# EAGLE schematic mbmc_single_board (EAGLE 9.6.2)
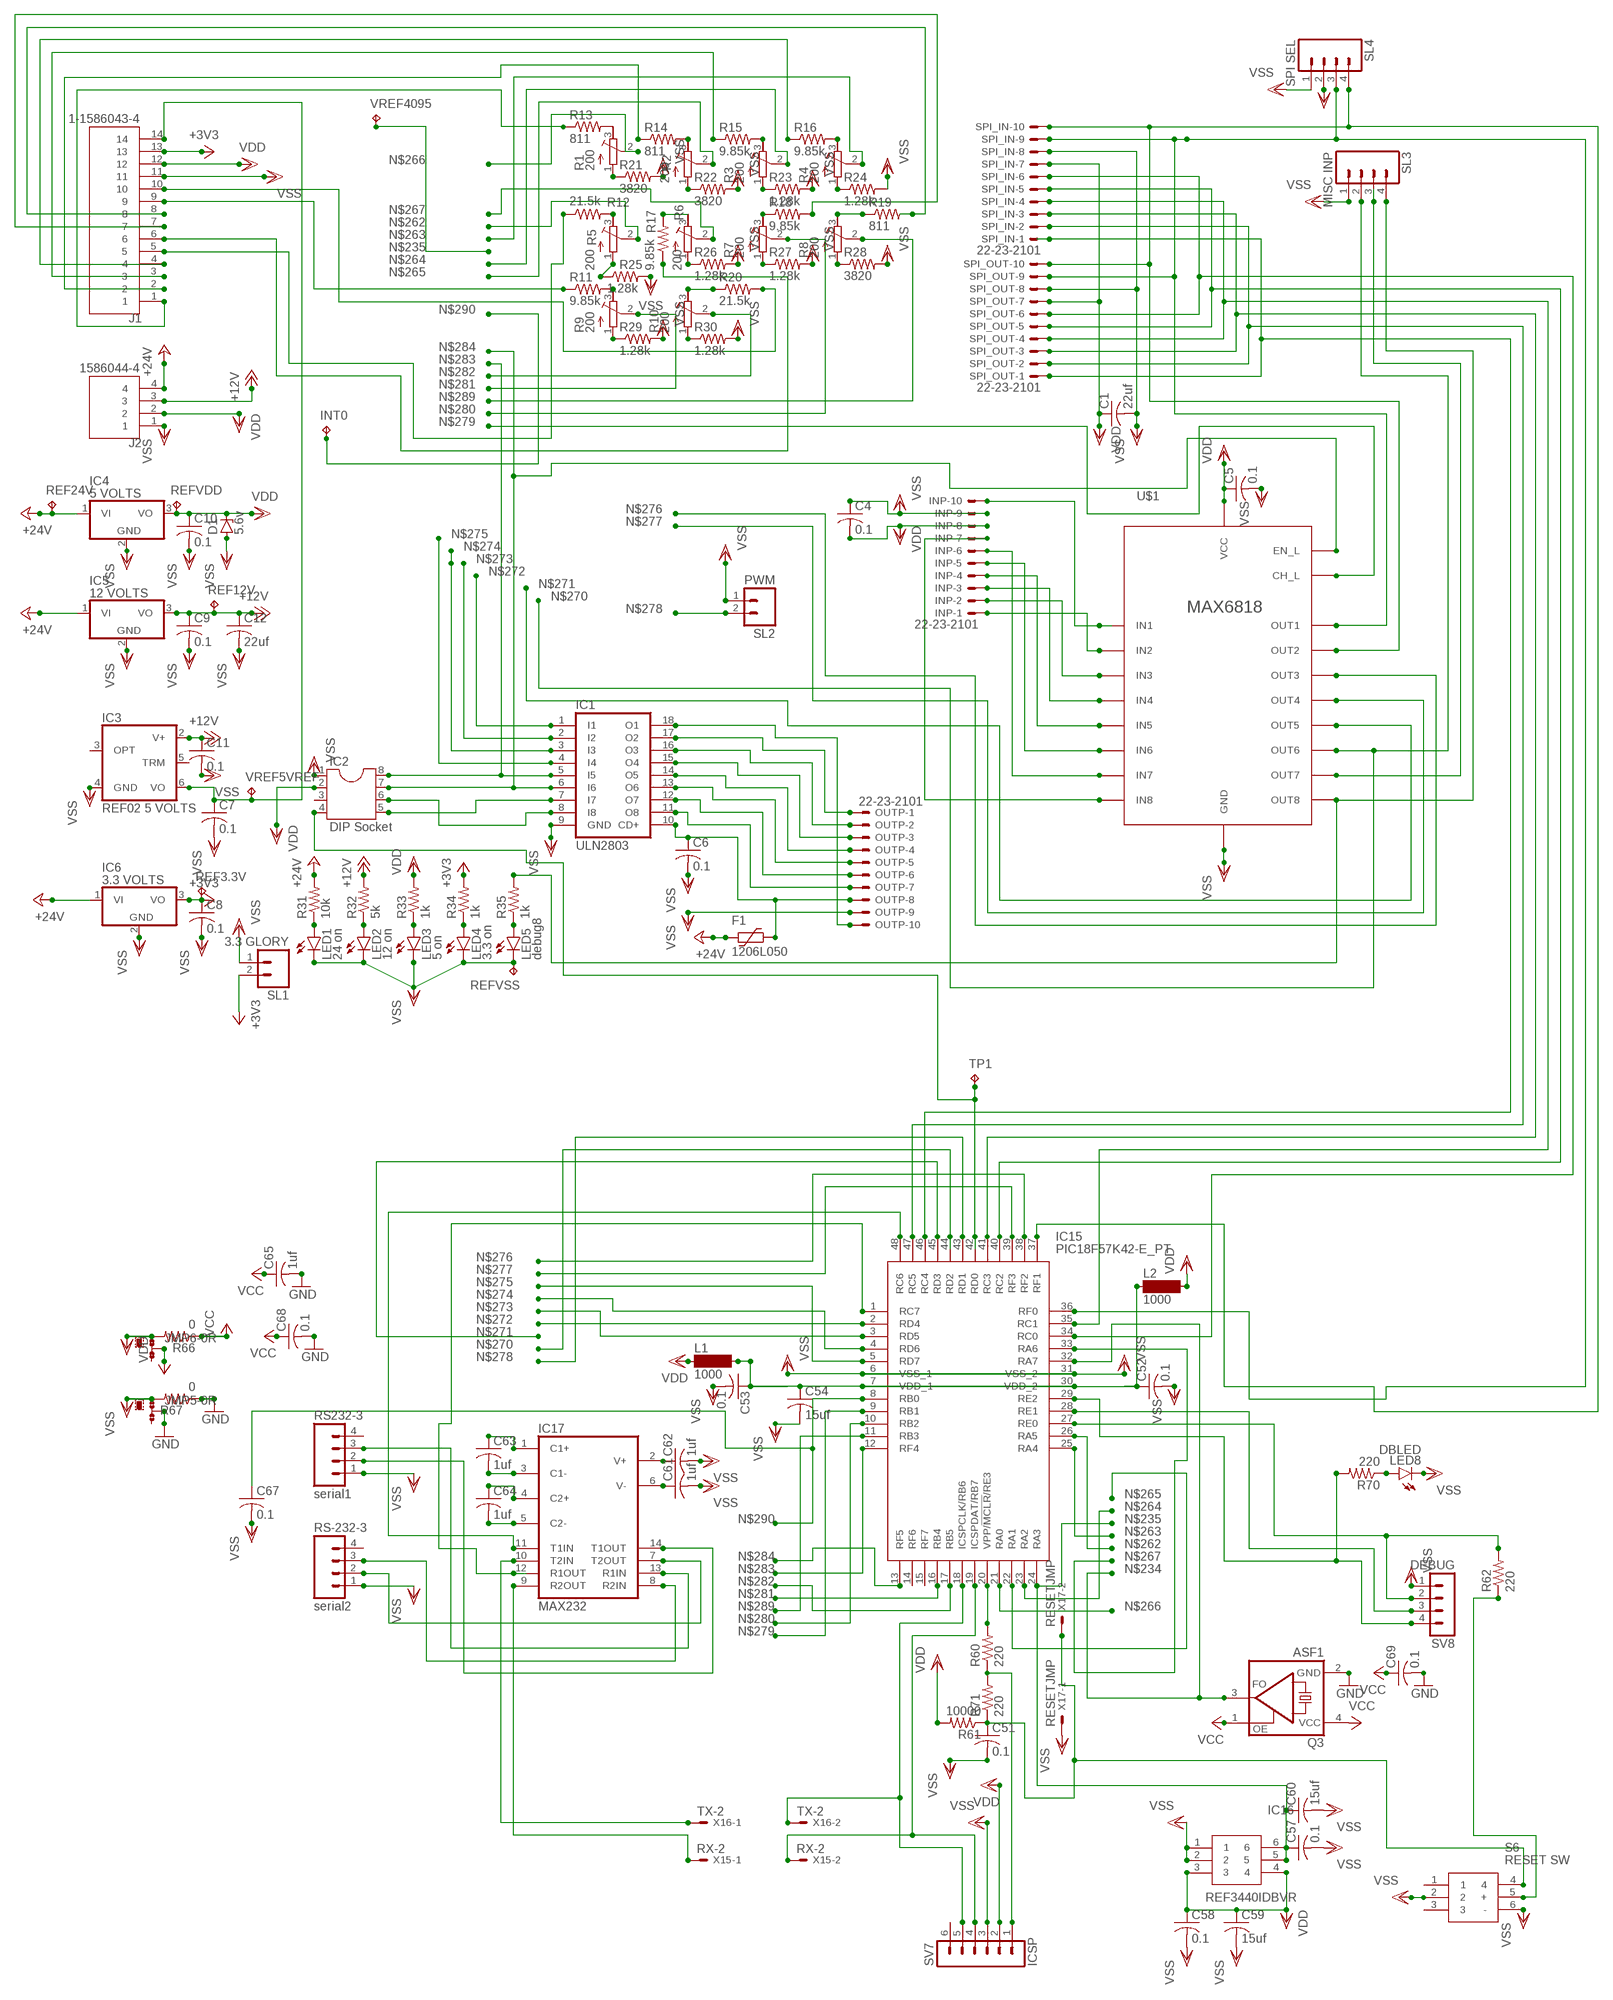
[diagram p0: schematic, sheet 1]

## Parts
C1  22uf  C-USC0805  [C0805]
C4  0.1  C-USC0805  [C0805]
C5  0.1  C-USC0805  [C0805]
C6  0.1  C-USC0805  [C0805]
C7  0.1  C-USC0805  [C0805]
C8  0.1  C-USC0805  [C0805]
C9  0.1  C-USC0805  [C0805]
C10  0.1  C-USC0805  [C0805]
C11  0.1  C-USC0805  [C0805]
C12  22uf  C-USC0805  [C0805]
C51  0.1  C-USC1206  [C1206]
C52  0.1  C-USC1206  [C1206]
C53  0.1  C-USC1206  [C1206]
C54  15uf  C-USC1206  [C1206]
C57  0.1  C-USC1206  [C1206]
C58  0.1  C-USC1206  [C1206]
C59  15uf  C-USC1206  [C1206]
C60  15uf  C-USC1206  [C1206]
C61  1uf  C-USC0805  [C0805]
C62  1uf  C-USC0805  [C0805]
C63  1uf  C-USC0805  [C0805]
C64  1uf  C-USC0805  [C0805]
C65  1uf  C-USC0805  [C0805]
C67  0.1  C-USC1206  [C1206]
C68  0.1  C-USC1206  [C1206]
C69  0.1  C-USC1206  [C1206]
D1  5.6v  ZENER-DIODEZD-2.5  [ZDIO-2.5]
F1  1206L050  [1206L]
IC1  ULN2803  ULN2803A  [DIL18]
IC2  DIP Socket  DIL8S  [SOCKET-08]
IC3  REF02 5 VOLTS  REF02Z  [DIL08]
IC4  5 VOLTS  7805TV  [TO220V]
IC5  12 VOLTS  7805TV  [TO220V]
IC6  3.3 VOLTS  7805TV  [TO220V]
IC15  PIC18F57K42-E_PT  [QFP50P900X900X120-48N]
IC16  REF3440IDBVR  [SOP95P280X145-6N]
IC17  MAX232  [DIL16]
INP  22-23-2101  [22-23-2101]
INT0  TPB1,27  [B1,27]
J1  1-1586043-4  [TE_1-1586043-4]
J2  1586044-4  [TE_1586044-4]
JMP5  0R-JUMPA  [A0R-JMP]
JMP6  0R-JUMPA  [A0R-JMP]
L1  1000  SM-1206  [SM-1206]
L2  1000  SM-1206  [SM-1206]
LED1  24 on  LEDCHIPLED_1206  [CHIPLED_1206]
LED2  12 on  LEDCHIPLED_1206  [CHIPLED_1206]
LED3  5 on  LEDCHIPLED_1206  [CHIPLED_1206]
LED4  3.3 on  LEDCHIPLED_1206  [CHIPLED_1206]
LED5  debug8  LEDCHIPLED_1206  [CHIPLED_1206]
LED8  DBLED  LEDCHIPLED_1206  [CHIPLED_1206]
OUTP  22-23-2101  [22-23-2101]
Q3  ASF1  [ASF]
R1  200  R-TRIMM3339P  [RTRIM3339P]
R2  200  R-TRIMM3339P  [RTRIM3339P]
R3  200  R-TRIMM3339P  [RTRIM3339P]
R4  200  R-TRIMM3339P  [RTRIM3339P]
R5  200  R-TRIMM3339P  [RTRIM3339P]
R6  200  R-TRIMM3339P  [RTRIM3339P]
R7  200  R-TRIMM3339P  [RTRIM3339P]
R8  200  R-TRIMM3339P  [RTRIM3339P]
R9  200  R-TRIMM3339P  [RTRIM3339P]
R10  200  R-TRIMM3339P  [RTRIM3339P]
R11  9.85k  R-US_R0805  [R0805]
R12  21.5k  R-US_R0805  [R0805]
R13  811  R-US_R0805  [R0805]
R14  811  R-US_R0805  [R0805]
R15  9.85k  R-US_R0805  [R0805]
R16  9.85k  R-US_R0805  [R0805]
R17  9.85k  R-US_R0805  [R0805]
R18  9.85k  R-US_R0805  [R0805]
R19  811  R-US_R0805  [R0805]
R20  21.5k  R-US_R0805  [R0805]
R21  3820  R-US_R0805  [R0805]
R22  3820  R-US_R0805  [R0805]
R23  1.28k  R-US_R0805  [R0805]
R24  1.28k  R-US_R0805  [R0805]
R25  1.28k  R-US_R0805  [R0805]
R26  1.28k  R-US_R0805  [R0805]
R27  1.28k  R-US_R0805  [R0805]
R28  3820  R-US_R0805  [R0805]
R29  1.28k  R-US_R0805  [R0805]
R30  1.28k  R-US_R0805  [R0805]
R31  10k  R-US_R0805  [R0805]
R32  5k  R-US_R0805  [R0805]
R33  1k  R-US_R0805  [R0805]
R34  1k  R-US_R0805  [R0805]
R35  1k  R-US_R0805  [R0805]
R60  220  R-US_R1206  [R1206]
R61  10000  R-US_R1206  [R1206]
R62  220  R-US_R1206  [R1206]
R66  0  R-US_R1206  [R1206]
R67  0  R-US_R1206  [R1206]
R70  220  R-US_R1206  [R1206]
R71  220  R-US_R1206  [R1206]
REF3.3V  TPB1,27  [B1,27]
REF12V  TPB1,27  [B1,27]
REF24V  TPB1,27  [B1,27]
REFVDD  TPB1,27  [B1,27]
REFVSS  TPB1,27  [B1,27]
RS232-3  serial1  M04  [04P]
RS-232-3  serial2  M04  [04P]
S6  RESET SW  B3W-9000-Y1N  [B3W-9_1-LED]
SL1  3.3 GLORY  M02  [02P]
SL2  PWM  M02  [02P]
SL3  MISC INP  M04  [04P]
SL4  SPI SEL  M04  [04P]
SPI_IN  22-23-2101  [22-23-2101]
SPI_OUT  22-23-2101  [22-23-2101]
SV7  ICSP  MA06-1  [MA06-1]
SV8  DEBUG  MA04-1  [MA04-1]
TP1  TPB1,27  [B1,27]
U$1  MAX6818  [SSOP20]
VREF5VREF  TPB1,27  [B1,27]
VREF4095  TPB1,27  [B1,27]
X15  RX-2  332-02  [332-02]
X16  TX-2  332-02  [332-02]
X17  RESETJMP  332-02  [332-02]

## Nets
+3V3 [i-line]: C8.1 IC6.3(VO) J1.13 R34.2 REF3.3V.TP SL1.2
+12V [i-line]: C9.1 C11.1 C12.1 IC3.2(V+) IC5.3(VO) J2.3 R32.2 REF12V.TP
+24V [i-line]: F1.2 IC4.1(VI) IC5.1(VI) IC6.1(VI) J2.4 R31.2 REF24V.TP
GND: C65.2 C68.2 C69.2 JMP5.2 Q3.2(GND) R67.1
N$1: R9.3(E) R11.2
N$2: R5.3(E) R12.2
N$3: R1.3(E) R13.2
N$4: R2.3(E) R14.2
N$5: R3.3(E) R15.2
N$6: R4.3(E) R16.2
N$7: R6.3(E) R17.2
N$8: J1.7 R18.2
N$9: R8.3(E) R19.1
N$10: J1.8 R19.2
N$11: R1.1(A) R21.1
N$12: R2.1(A) R22.1
N$13: R3.1(A) R23.1
N$14: R4.1(A) R24.1
N$15: R5.1(A) R25.1
N$16: R6.1(A) R26.1
N$17: R7.1(A) R27.1
N$18: R8.1(A) R28.1
N$19: R9.1(A) R29.1
N$20: R10.1(A) R30.1
N$21 [i-line]: C6.1 F1.1 IC1.10(CD+) OUTP.8
N$22 [i-line]: C52.1 C53.1 C54.1 IC15.7(VDD_1) IC15.30(VDD_2) L1.2 L2.1
N$24: J1.2 R14.1
N$37: IC1.7(I7) IC2.5
N$38: IC1.8(I8) IC2.6
N$39: IC15.36(RF0) SL4.3 SPI_IN.9 SPI_OUT.9 U$1.OUT1
N$44: INP.10 U$1.IN1
N$46: INP.1 U$1.IN2
N$47: INP.2 U$1.IN3
N$48: INP.3 U$1.IN4
N$49: INP.4 U$1.IN5
N$50: INP.5 U$1.IN6
N$51: INP.6 U$1.IN7
N$52: INP.7 U$1.IN8
N$53: IC1.18(O1) OUTP.10
N$54: IC1.17(O2) OUTP.1
N$55: IC1.16(O3) OUTP.2
N$56: IC1.15(O4) OUTP.3
N$57: IC1.14(O5) OUTP.4
N$58: IC1.13(O6) OUTP.5
N$59: IC1.12(O7) OUTP.6
N$60: IC1.11(O8) OUTP.7
N$61: C7.1 IC3.6(VO) J1.14 VREF5VREF.TP
N$67: IC15.46(RC4) SPI_IN.1 SPI_OUT.1
N$68: J1.4 R16.1
N$69: J1.9 R11.1
N$70: J1.3 R15.1
N$71: J1.10 R20.2
N$72: J1.5 R12.1
N$73: J1.6 R17.1
N$74: J1.1 R13.1
N$76: LED1.A R31.1
N$77: LED2.A R32.1
N$78: LED3.A R33.1
N$79: LED4.A R34.1
N$80: LED5.A R35.1
N$81: R35.2 SL3.4 U$1.OUT8
N$83: R10.3(E) R20.1
N$84: SL3.3 U$1.OUT7
N$88: R7.3(E) R18.1
N$89: IC17.8(R2IN) RS-232-3.3
N$90: IC17.14(T1OUT) RS232-3.2
N$231: IC15.20(VPP/!MCLR!/RE3) R60.2
N$232: IC15.19(ICSPDAT/RB7) SV7.4 X15.2
N$233: IC15.18(ICSPCLK/RB6) SV7.5 X16.2
N$234: IC15.32(RA7) Q3.3(FO)
N$235: C57.1 C60.1 IC15.24(RA3) IC16.5 IC16.6 VREF4095.TP
N$236: C61.1 IC17.6(V-)
N$237: C62.1 IC17.2(V+)
N$238: C63.1 IC17.1(C1+)
N$239: C64.1 IC17.4(C2+)
N$240: C64.2 IC17.5(C2-)
N$241: C63.2 IC17.3(C1-)
N$243: IC17.7(T2OUT) RS-232-3.2
N$244: IC17.13(R1IN) RS232-3.3
N$245: IC15.1(RC7) IC17.12(R1OUT)
N$246: IC17.9(R2OUT) X15.1
N$247: IC15.48(RC6) IC17.11(T1IN)
N$248: IC17.10(T2IN) X16.1
N$249: R62.1 S6.5(+)
N$250: IC15.27(RE0) R62.2 SV8.2
N$251: IC15.28(RE1) SV8.3
N$252: IC15.29(RE2) R70.2 SV8.4
N$255: IC2.4 IC15.42(RD0) TP1.TP
N$257: IC15.47(RC5) SPI_IN.2 SPI_OUT.2
N$258: IC15.41(RC3) SPI_IN.3 SPI_OUT.3
N$259: IC15.35(RC1) SPI_IN.4 SPI_OUT.4
N$260: IC15.40(RC2) SPI_IN.5 SPI_OUT.5
N$261: IC15.34(RC0) SPI_IN.6 SPI_OUT.6
N$262: IC15.26(RA5) R5.2(S)
N$263: IC15.25(RA4) R4.2(S)
N$264: IC15.23(RA2) R3.2(S)
N$265: IC15.22(RA1) R2.2(S)
N$266: IC15.21(RA0) R1.2(S)
N$267: IC15.33(RA6) R6.2(S)
N$268: IC15.37(RF1) SL4.4 SPI_IN.10 SPI_OUT.10 U$1.OUT2
N$270: IC15.44(RD2) SL3.2 U$1.OUT6
N$271: IC15.45(RD3) U$1.OUT5
N$272: IC1.1(I1) IC15.2(RD4)
N$273: IC1.2(I2) IC15.3(RD5)
N$274: IC1.3(I3) IC15.4(RD6)
N$275: IC1.4(I4) IC15.5(RD7)
N$276: IC15.38(RF2) U$1.OUT3
N$277: IC15.39(RF3) U$1.OUT4
N$278: IC15.43(RD1) SL2.2
N$279: IC15.9(RB1) U$1.CH_L
N$280: IC15.10(RB2) R7.2(S)
N$281: IC15.16(RB4) R9.2(S)
N$282: IC15.17(RB5) R10.2(S)
N$283: IC1.5(I5) IC2.8 IC15.12(RF4)
N$284: IC1.6(I6) IC2.7 IC15.13(RF5) U$1.EN_L
N$289: IC15.11(RB3) R8.2(S)
N$290: C67.1 IC15.8(RB0) INT0.TP
N$295: LED8.A R70.1
N$299: C51.1 R61.1 R71.1 S6.4 X17.2
N$300: R60.1 R71.2 SV7.1
VCC: C65.1 C68.1 C69.1 JMP6.2 Q3.1(OE) Q3.4(VCC) R66.1
VDD [i-line]: C1.1 C4.2 C5.1 C10.1 C58.1 C59.1 D1.C IC2.2 IC4.3(VO) IC16.3 IC16.4 INP.8 J1.12 J2.2 JMP6.1 L1.1 L2.2 R33.2 R61.2 R66.2 REFVDD.TP SL4.2 SPI_IN.7 SPI_OUT.7 SV7.2 U$1.VCC
VSS [i-line]: C1.2 C4.1 C5.2 C6.2 C7.2 C8.2 C9.2 C10.2 C11.2 C12.2 C51.2 C52.2 C53.2 C54.2 C57.2 C58.2 C59.2 C60.2 C61.2 C62.2 C67.2 D1.A IC1.9(GND) IC2.1 IC3.4(GND) IC4.2(GND) IC5.2(GND) IC6.2(GND) IC15.6(VSS_1) IC15.31(VSS_2) IC16.1 IC16.2 INP.9 J1.11 J2.1 JMP5.1 LED1.C LED2.C LED3.C LED4.C LED5.C LED8.C OUTP.9 R21.2 R22.2 R23.2 R24.2 R25.2 R26.2 R27.2 R28.2 R29.2 R30.2 R67.2 REFVSS.TP RS232-3.1 RS-232-3.1 S6.2 S6.6(-) SL1.1 SL2.1 SL3.1 SL4.1 SPI_IN.8 SPI_OUT.8 SV7.3 SV8.1 U$1.GND X17.1
Unconnected: IC2.3 IC3.3(OPT) IC3.5(TRM) IC15.14(RF6) IC15.15(RF7) JMP5.3 JMP6.3 RS232-3.4 RS-232-3.4 S6.1 S6.3 SV7.6

## Power pins joined to a net without a drawn wire
GND: IC17.15(GND)
VCC: IC17.16(VCC)

## Library data of the parts
C1 C4-C12 C51-C54 C57-C65 C67-C69 = rcl:C-US: CAPACITOR, American symbol; SPICEPREFIX: C
D1 = diode:ZENER-DIODE: Z-Diode
F1 = polyfuse-smd_10:?: Polyfuse Resettable PTC Source: http://www.littelfuse.com/products/resettable-ptcs.aspx; MF: Littelfuse; MPN: 1206L050; OC_FARNELL: 1596993; OC_NEWARK: 53M6118
IC1 = uln-udn:ULN2803A: DRIVER ARRAY
IC2 = ic-package:DIL8: Dual In Line / Socket
IC3 = linear:REF02: VOLTAGE REFERENCE
IC4-IC6 = linear:78*: Positive VOLTAGE REGULATOR Source: http://cache.national.com/ds/LM/LM78L05.pdf http://www.fairchildsemi.com/ds/LM/LM7805.pdf
IC15 = SamacSys_Parts:PIC18F57K42-E_PT: 8-bit Microcontrollers - MCU 128KB Flash, 8KB RAM, 256B EEPROM, 12-bit ADC2, Vector Interrupts, DMA, MAP, DIA, DAC, Comp, PWM, CWG, HLT, WWDT, SCAN/CRC, ZCD, PPS, EUSART, SPI/I2C, IDLE/DOZE/PMD Source: Datasheet <https://componentsearchengine.com/Datasheets/1/PIC18F57K42-E_PT.pdf>; DESCRIPTION: 8-bit Microcontrollers - MCU 128KB Flash, 8KB RAM, 256B EEPROM, 12-bit ADC2, Vector Interrupts, DMA, MAP, DIA, DAC, Comp, PWM, CWG, HLT, WWDT, SCAN/CRC, ZCD, PPS, EUSART, SPI/I2C, IDLE/DOZE/PMD; HEIGHT: 1.2mm; MANUFACTURER_NAME: Microchip; MANUFACTURER_PART_NUMBER: PIC18F57K42-E/PT; MOUSER_PART_NUMBER: 579-PIC18F57K42-E/PT
IC16 = SamacSys_Parts:REF3440IDBVR: 4.1V Low-Drift Low-Power Small-Footprint Series Voltage Reference Source: Datasheet <http://www.ti.com/lit/gpn/ref3440>; DESCRIPTION: 4.1V Low-Drift Low-Power Small-Footprint Series Voltage Reference; HEIGHT: 1.45mm; MANUFACTURER_NAME: Texas Instruments; MANUFACTURER_PART_NUMBER: REF3440IDBVR
IC17 = maxim:MAX232: RS232 TRANSCEIVER; MF: MAXIM; MPN: MAX232ACPE+; OC_FARNELL: 9723773; OC_NEWARK: 68K4544
INP OUTP SPI_IN SPI_OUT = con-molex:22-23-2101: .100" (2.54mm) Center Header - 10 Pin; MF: MOLEX; MPN: 22-23-2101; OC_FARNELL: 1756828; OC_NEWARK: 94C0765
INT0 REF3.3V REF12V REF24V REFVDD REFVSS TP1 VREF5VREF VREF4095 = testpad:TP: Test pad
J1 = 1-1586043-4:1-1586043-4; MANUFACTURER: TE; PARTREV: R; STANDARD: Manufacturer Recommendations
J2 = 1586044-4:1586044-4; MANUFACTURER: TE; PARTREV: R; STANDARD: Manufacturer Recommendations
JMP5 JMP6 = jump-0r-smd:0R-JUMP: SMD 0R 0805 Jumper
L1 L2 = inductor-neosid:SM-1206: INDUCTOR SMD chip inductor; OC_FARNELL: unknown; OC_NEWARK: unknown
LED1-LED5 LED8 = led:LED: LED OSRAM: - CHIPLED LG R971, LG N971, LY N971, LG Q971, LY Q971, LO R971, LY R971 LH N974, LH R974 LS Q976, LO Q976, LY Q976 LO Q996 - Hyper CHIPLED LW Q18S LB Q993, LB Q99A, LB R99A - SideLED LS A670, LO A670, LY A670, LG A670, LP A670 LB A673, LV A673, LT A673, LW A673 LH A674 LY A675 LS A676, LA A676, LO A676, LY A676, LW A676 LS A679, LY A679, LG A679 - Hyper Micro SIDELED® LS Y876, LA Y876, LO Y876, LY Y876 LT Y87S - SmartLED LW L88C, LW L88S LB L89C, LB L89S, LG L890 LS L89K, LO L89K, LY L89K LS L896, LA L896, LO L896, LY L896 - TOPLED LS T670, LO T670, LY T670, LG T670, LP T670 LSG T670, LSP T670, LSY T670, LOP T670, LYG T670 LG T671, LOG T671, LSG T671 LB T673, LV T673, LT T673, LW T673 LH T674 LS T676, LA T676, LO T676, LY T676, LB T676, LH T676, LSB T676, LW T676 LB T67C, LV T67C, LT T67C, LS T67K, LO T67K, LY T67K, LW E67C LS E67B, LA E67B, LO E67B, LY E67B, LB E67C, LV E67C, LT E67C LW T67C LS T679, LY T679, LG T679 LS T770, LO T770, LY T770, LG T770, LP T770 LB T773, LV T773, LT T773, LW T773 LH T774 LS E675, LA E675, LY E675, LS T675 LS T776, LA T776, LO T776, LY T776, LB T776 LHGB T686 LT T68C, LB T68C - Hyper Mini TOPLED® LB M676 - Mini TOPLED Santana® LG M470 LS M47K, LO M47K, LY M47K Source: http://www.osram.convergy.de LUXEON: - LUMILED® LXK2-PW12-R00, LXK2-PW12-S00, LXK2-PW14-U00, LXK2-PW14-V00 LXK2-PM12-R00, LXK2-PM12-S00, LXK2-PM14-U00 LXK2-PE12-Q00, LXK2-PE12-R00, LXK2-PE12-S00, LXK2-PE14-T00, LXK2-PE14-U00 LXK2-PB12-K00, LXK2-PB12-L00, LXK2-PB12-M00, LXK2-PB14-N00, LXK2-PB14-P00, LXK2-PB14-Q00 LXK2-PR12-L00, LXK2-PR12-M00, LXK2-PR14-Q00, LXK2-PR14-R00 LXK2-PD12-Q00, LXK2-PD12-R00, LXK2-PD12-S00 LXK2-PH12-R00, LXK2-PH12-S00 LXK2-PL12-P00, LXK2-PL12-Q00, LXK2-PL12-R00 Source: www.luxeon.com KINGBRIGHT: KA-3528ASYC Source: www.kingbright.com
Q3 = crystal:ASF*: CRYSTAL CLOCK OSCILLATORS 5.0 Vdc or 3.3 Vdc - LOW PROFILE ULTRA MINIATURE CERAMIC SURFACE MOUNT Source: http://www.abracon.com/Oscillators/asf1-L-L1.pdf; OC_FARNELL: unknown; OC_NEWARK: unknown
R1-R10 = rcl:R-TRIMM: Trimm resistor; SPICEMODEL: X; SPICEPREFIXL: POT
R11-R35 R60-R62 R66 R67 R70 R71 = rcl:R-US_: RESISTOR, American symbol; SPICEPREFIX: R
RS232-3 RS-232-3 SL3 SL4 = con-amp-quick:M04: AMP QUICK CONNECTOR; OC_FARNELL: unknown; OC_NEWARK: unknown
S6 = SamacSys_Parts:B3W-9000-Y1N: Illuminated Tactile Switches Illuminated Ylw LED White Cap Source: Datasheet <http://www.mouser.com/ds/2/307/en-b3w-9-11824.pdf>; ALLIED_NUMBER: 70176005; ALLIED_PRICE-STOCK: https://www.alliedelec.com/omron-electronic-components-b3w-9000-y1n/70176005/; DESCRIPTION: Illuminated Tactile Switches Illuminated Ylw LED White Cap; HEIGHT: mm; MANUFACTURER_NAME: Omron Electronics; MANUFACTURER_PART_NUMBER: B3W-9000-Y1N; MOUSER_PART_NUMBER: 653-B3W-9000-Y1N; MOUSER_PRICE-STOCK: https://www.mouser.com/Search/Refine.aspx?Keyword=653-B3W-9000-Y1N; RS_PART_NUMBER: 0492777P; RS_PRICE-STOCK: http://uk.rs-online.com/web/p/products/0492777P
SL1 SL2 = con-amp-quick:M02: AMP QUICK CONNECTOR; OC_FARNELL: unknown; OC_NEWARK: unknown
SV7 = con-lstb:MA06-1: PIN HEADER; OC_FARNELL: unknown; OC_NEWARK: unknown
SV8 = con-lstb:MA04-1: PIN HEADER; OC_FARNELL: unknown; OC_NEWARK: unknown
U$1 = MAX6818:MAX6818; AVAILABILITY: Unavailable; MF: Maxim Integrated; MP: MAX6818; PACKAGE: None; PRICE: None
X15-X17 = con-garry:332-02: 2 Pin - 2mm Dual Row Source: www.mpe-connector.de / garry_shortform_2012.pdf

## Net classes
1 i-line: width 0.3 mm